# Altium schematic sheet 5V_Block.SchDoc
size A4; SheetNumber: 7; SheetTotal: 18
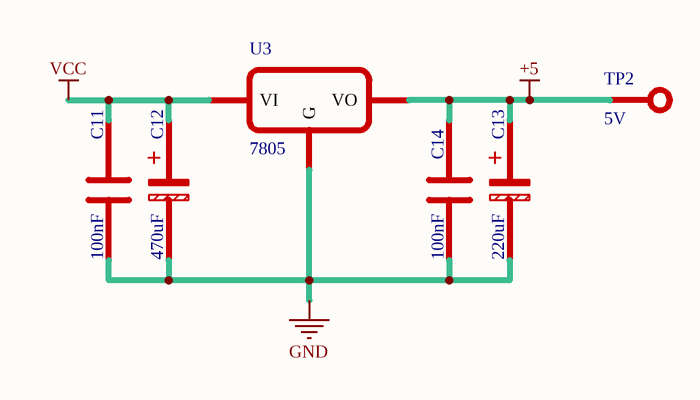
[diagram p0: 5V_Block.SchDoc]

## Parts
C11  100nF  [C0805]
C12  470uF  [CAP-AL-4x5.4]
C13  220uF  [CAP-AL-4x5.4]
C14  100nF  [C0805]
TP2  5V  [Test Point]
U3  7805  [TO-252]

## Nets
+5: C13.1 C14.2 TP2.1 U3.3(VO)
GND: C11.1 C12.2 C13.2 C14.1 U3.2(G)
VCC: C11.2 C12.1 U3.1(VI)

## Notes on the sheet
- (in symbol CAP-ALU) +

## Library data of the parts
C11 C14 = CAP-CER: Ceramic Capacitor
C12 C13 = CAP-ALU: Aluminum Capacitor
TP2 = TestPoint: Test Point
U3 = 78xx: Regulator intergated chip Series (7805-7808-7812-7815-7824); pin to pad: 2>3 3>4; ComponentLink1Description: 7805 Datasheet; ComponentLink1URL: https://mm.digikey.com/Volume0/opasdata/d220001/medias/docus/1176/MC7800%28A%2CAE%29%2CNCV7800.pdf